# Altium schematic sheet CAN.SchDoc: Bernardo
size A3; Date: 14/11/2018; DrawnBy: Wim Van Gool; Revision: 01; SheetNumber: 7; SheetTotal: 7
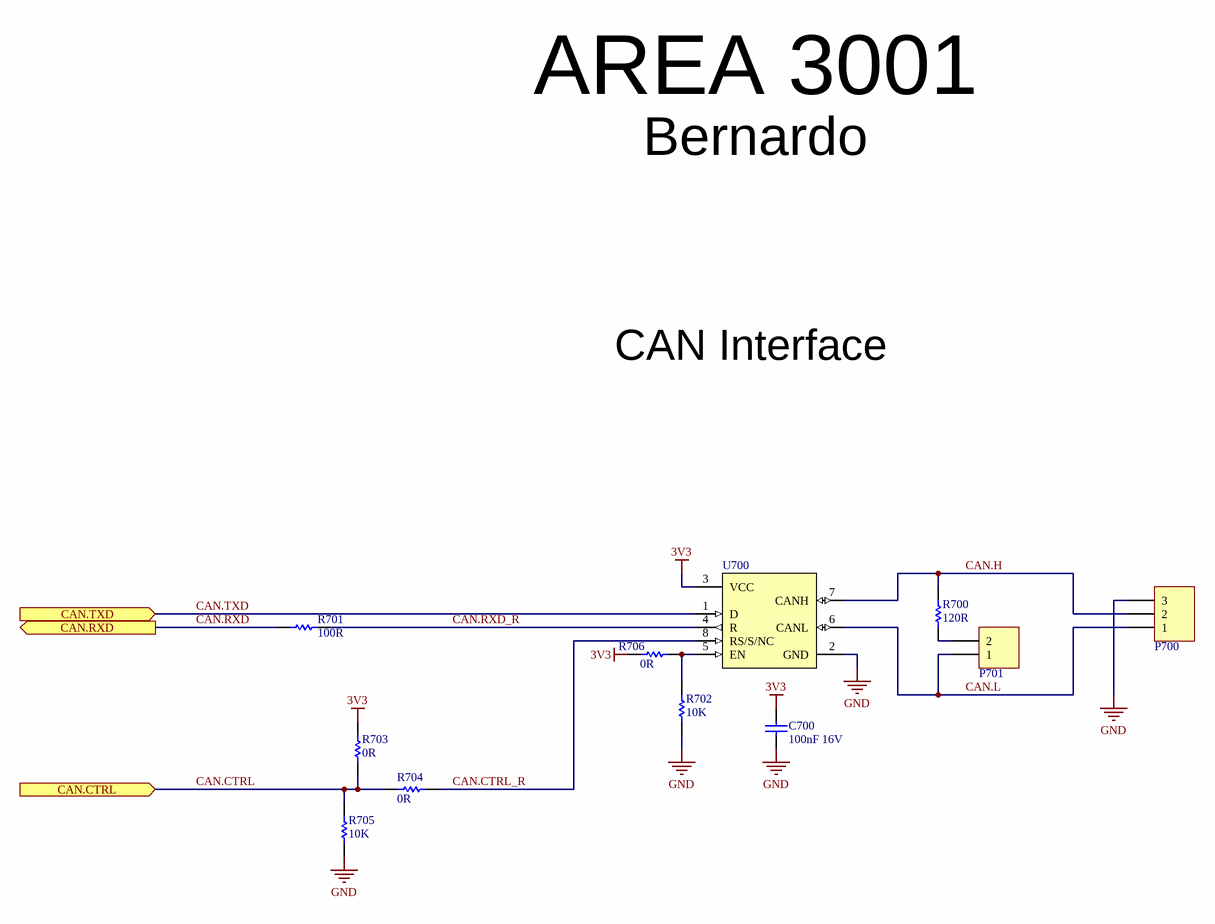
[diagram p0: CAN.SchDoc]

## Parts
C700  value 100nF 16V  [C0603_N]  (hidden comment: CAP_CERAMIC)
P700  3 Terminal Socket 2,5mm  [WE_691382000003]  (value not drawn)
P701  Header 2  [HDR1X2]  (value not drawn)
R700  value 120R  [R1206]  (hidden comment: RESISTOR)
R701  value 100R  [R0603_N]  (hidden comment: RESISTOR)
R702  value 10K  [R0603_N]  (hidden comment: RESISTOR)
R703  value 0R  [R0603_N]  (hidden comment: RESISTOR)
R704  value 0R  [R0603_N]  (hidden comment: RESISTOR)
R705  value 10K  [R0603_N]  (hidden comment: RESISTOR)
R706  value 0R  [R0603_N]  (hidden comment: RESISTOR)
U700  CAN Transceiver 1Mbps 3V3  [SOIC_N_8]  (value not drawn)

## Ports
CAN.CTRL (in), CAN.RXD (out), CAN.TXD (in)

## Nets
3V3: C700.1 R703.1 R706.1 U700.3(VCC)
GND: C700.2 P700.3 R702.2 R705.2 U700.2(GND)
CAN.CTRL: R703.2 R704.1 R705.1 ; port CAN.CTRL
CAN.CTRL_R: R704.2 U700.8(RS/S/NC)
CAN.H: P700.2 R700.1 U700.7(CANH)
CAN.L: P700.1 P701.1 U700.6(CANL)
CAN.RXD: R701.2 ; port CAN.RXD
CAN.RXD_R: R701.1 U700.4(R)
CAN.TXD: U700.1(D) ; port CAN.TXD
NetP701_2: P701.2 R700.2
NetR702_1: R702.1 R706.2 U700.5(EN)

## Notes on the sheet
- AREA 3001
- Bernardo
- CAN Interface
- Title
- Revision
- Date
- Dranw By
- Size
- A3
- Sheet
- of

## Library data of the parts
C700 = CAP # 100nF 16V 0603: Capacitor Ceramic
P700 = Terminal Block Socket 2,5mm 3way - 691382000003: Value: 691382000003; Supplier 1: Wurth; Supplier Part Number 1: 691382000003
P701 = Pin Header 2.54mm 2way
R700 = RES # 120R 1206
R701 = RES # 100R 0603
R702 R705 = RES # 10K 0603: Supplier 1: Farnell; Supplier Part Number 1: 2502397
R703 R704 R706 = RES # 0R 0603: Supplier 1: Farnell; Supplier Part Number 1: 2447743
U700 = SN65HVD232DR CAN Transceiver 1Mbps: =Description; Value: SN65HVD232DR; Supplier 1: Farnell; Supplier Part Number 1: 1103107; Supplier 2: Digi-key; Supplier Part Number 2: 296-26344-1-ND